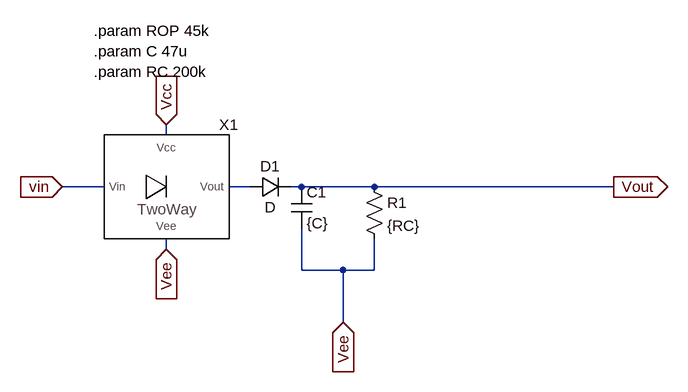
[diagram p0: schematic Hüllkurvendetektor_Ver2.asc]
Hüllkurvendetektor_Ver2.asc, the LTspice schematic file:
Version 4
SHEET 1 1584 680
WIRE 304 112 304 96
WIRE 208 192 144 192
WIRE 432 192 400 192
WIRE 512 192 496 192
WIRE 624 192 512 192
WIRE 992 192 624 192
WIRE 304 288 304 272
WIRE 512 320 512 256
WIRE 576 320 512 320
WIRE 624 320 624 272
WIRE 624 320 576 320
WIRE 576 400 576 320
FLAG 304 96 Vcc
IOPIN 304 96 In
FLAG 304 288 Vee
IOPIN 304 288 In
FLAG 992 192 Vout
IOPIN 992 192 Out
FLAG 576 400 Vee
IOPIN 576 400 In
FLAG 144 192 vin
IOPIN 144 192 In
SYMBOL cap 496 192 R0
SYMATTR InstName C1
SYMATTR Value {C}
SYMBOL res 608 176 R0
SYMATTR InstName R1
SYMATTR Value {RC}
SYMBOL PraezisionsVollweggleichrichter_Variante_Addierer 304 192 R0
SYMATTR InstName X1
SYMBOL diode 432 208 R270
WINDOW 0 32 32 VTop 2
WINDOW 3 0 32 VBottom 2
SYMATTR InstName D1
TEXT 192 -48 Left 2 !.param ROP 45k\n.param C 47u\n.param RC 200k

The netlist it stands for:
* Hüllkurvendetektor_Ver2.asc
C1 Vout Vee {C}
R1 Vout Vee {RC}
XX1 Vcc Vee vin N001 PraezisionsVollweggleichrichter_Variante_Addierer  ; pins Vcc Vee Vin Vout
D1 N001 Vout D
.model D D
.lib standard.dio
.param ROP 45k
.param C 47u
.param RC 200k
.backanno
.end